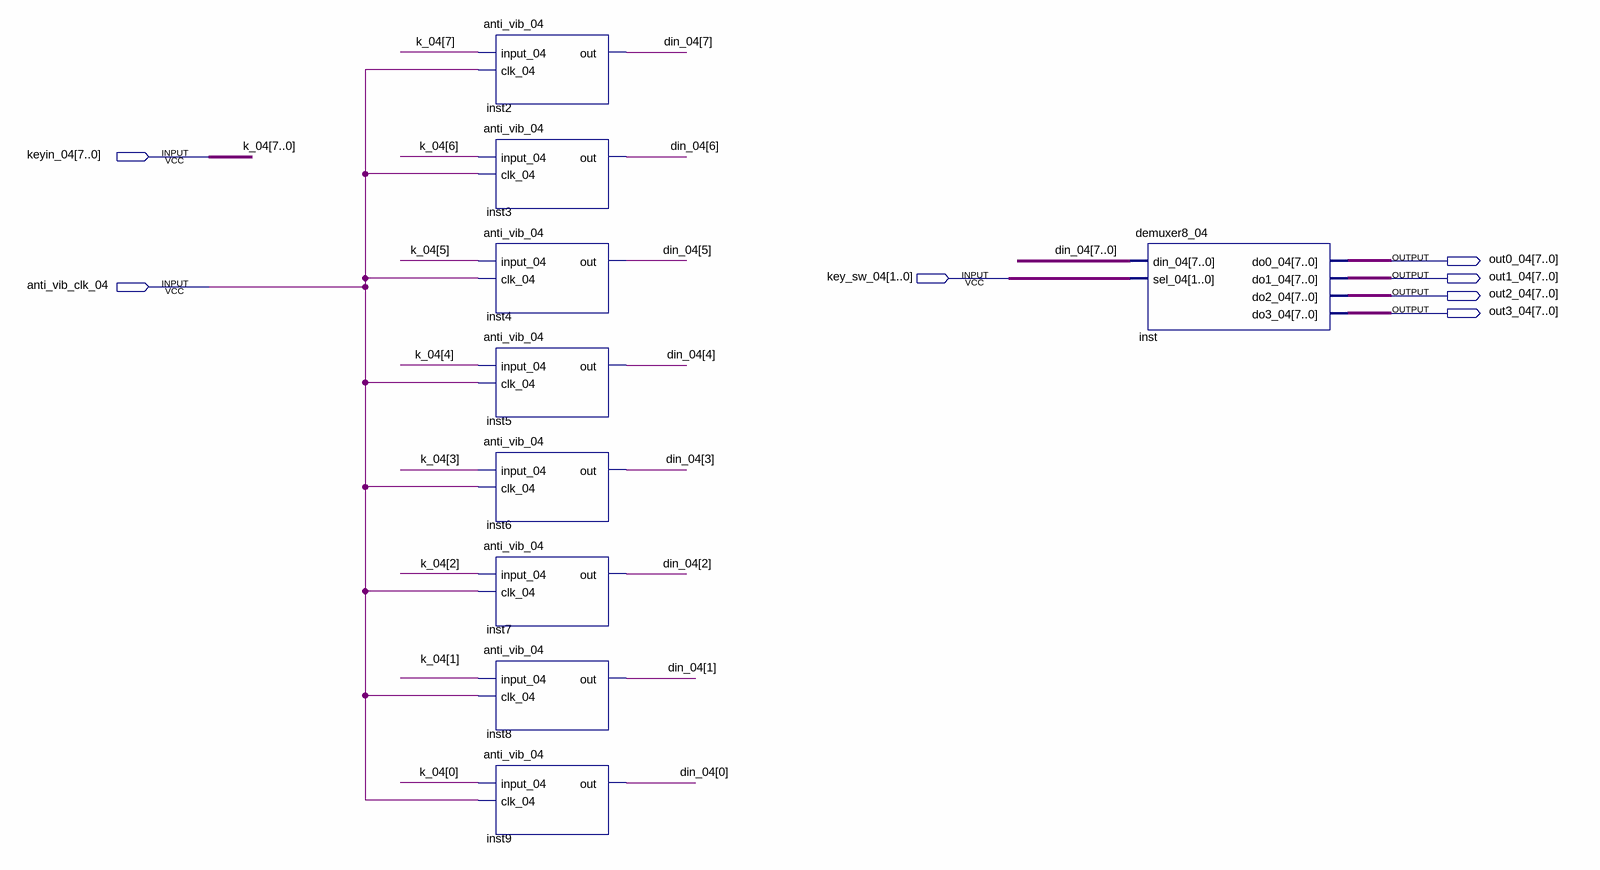
[diagram p0: schematic sheet]
// Quartus schematic keyboard_04.bdf as structural Verilog: 9 symbols, 7 pins
module keyboard_04 (
  input  [7:0] keyin_04,
  input  [1:0] key_sw_04,
  input  anti_vib_clk_04,
  output [7:0] out0_04,
  output [7:0] out1_04,
  output [7:0] out2_04,
  output [7:0] out3_04
);

  wire [7:0] din_04;

  anti_vib_04 inst2 (.input_04(keyin_04[7]), .clk_04(anti_vib_clk_04), .out(din_04[7]));
  anti_vib_04 inst3 (.input_04(keyin_04[6]), .clk_04(anti_vib_clk_04), .out(din_04[6]));
  anti_vib_04 inst4 (.input_04(keyin_04[5]), .clk_04(anti_vib_clk_04), .out(din_04[5]));
  anti_vib_04 inst5 (.input_04(keyin_04[4]), .clk_04(anti_vib_clk_04), .out(din_04[4]));
  anti_vib_04 inst6 (.input_04(keyin_04[3]), .clk_04(anti_vib_clk_04), .out(din_04[3]));
  anti_vib_04 inst7 (.input_04(keyin_04[2]), .clk_04(anti_vib_clk_04), .out(din_04[2]));
  anti_vib_04 inst8 (.input_04(keyin_04[1]), .clk_04(anti_vib_clk_04), .out(din_04[1]));
  anti_vib_04 inst9 (.input_04(keyin_04[0]), .clk_04(anti_vib_clk_04), .out(din_04[0]));
  demuxer8_04 inst (
    .din_04(din_04), .sel_04(key_sw_04), .do0_04(out0_04), .do1_04(out1_04), .do2_04(out2_04),
    .do3_04(out3_04));

  // Other names for the same wires on the sheet: k_04[7:0] = keyin_04
endmodule
